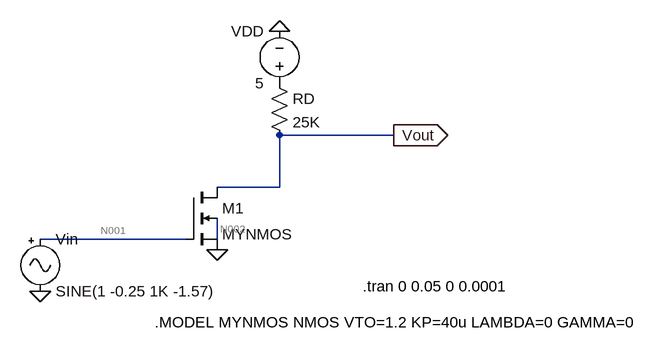
[diagram p0: schematic HW 9 #1b-1.asc]
HW 9 #1b-1.asc, the LTspice schematic file:
Version 4
SHEET 1 880 680
WIRE 336 176 160 176
WIRE 160 256 160 176
WIRE 160 256 64 256
WIRE 16 336 -208 336
WIRE 64 336 64 304
FLAG 160 16 0
FLAG 336 176 Vout
IOPIN 336 176 Out
FLAG 64 352 0
FLAG -208 416 0
SYMBOL res 144 80 R0
SYMATTR InstName RD
SYMATTR Value 25K
SYMBOL voltage 160 112 R180
WINDOW 0 24 96 Left 2
WINDOW 3 24 16 Left 2
SYMATTR InstName VDD
SYMATTR Value 5
SYMBOL nmos4 16 256 R0
SYMATTR InstName M1
SYMATTR Value2 l=1u w=100u
SYMATTR Value MYNMOS
SYMBOL Misc\\signal -208 320 R0
WINDOW 123 0 0 Left 0
WINDOW 39 0 0 Left 0
SYMATTR InstName Vin
SYMATTR Value SINE(1 -0.25 1K -1.57)
TEXT -32 464 Left 2 !.MODEL MYNMOS NMOS VTO=1.2 KP=40u LAMBDA=0 GAMMA=0
TEXT 288 408 Left 2 !.tran 0 0.05 0 0.0001

The netlist it stands for:
* HW 9 #1b-1.asc
RD P001 Vout 25K
VDD P001 0 5
M1 Vout N001 0 N002 MYNMOS l=1u w=100u
Vin N001 0 SINE(1 -0.25 1K -1.57)
.model NMOS NMOS
.model PMOS PMOS
.lib standard.mos
.MODEL MYNMOS NMOS VTO=1.2 KP=40u LAMBDA=0 GAMMA=0
.tran 0 0.05 0 0.0001
.backanno
.end

* Results of the author's LTspice run, read from the files saved beside the schematic
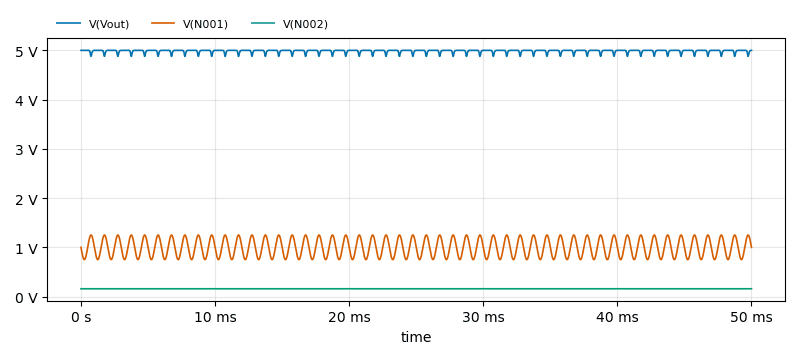
[diagram p1: Transient Analysis of HW 9 #1b-1.asc, plotted from the saved traces]
* Transient Analysis, 1 run:
*   V(Vout): min 4.878 V, max 5 V, average 4.984 V, rms 4.984 V, last 5 V
*   V(N001): min 750.9 mV, max 1.25 V, average 1 V, rms 1.016 V, last 1 V
*   V(N002): min 157.6 mV, max 158.3 mV, average 158.2 mV, rms 158.2 mV, last 158.3 mV